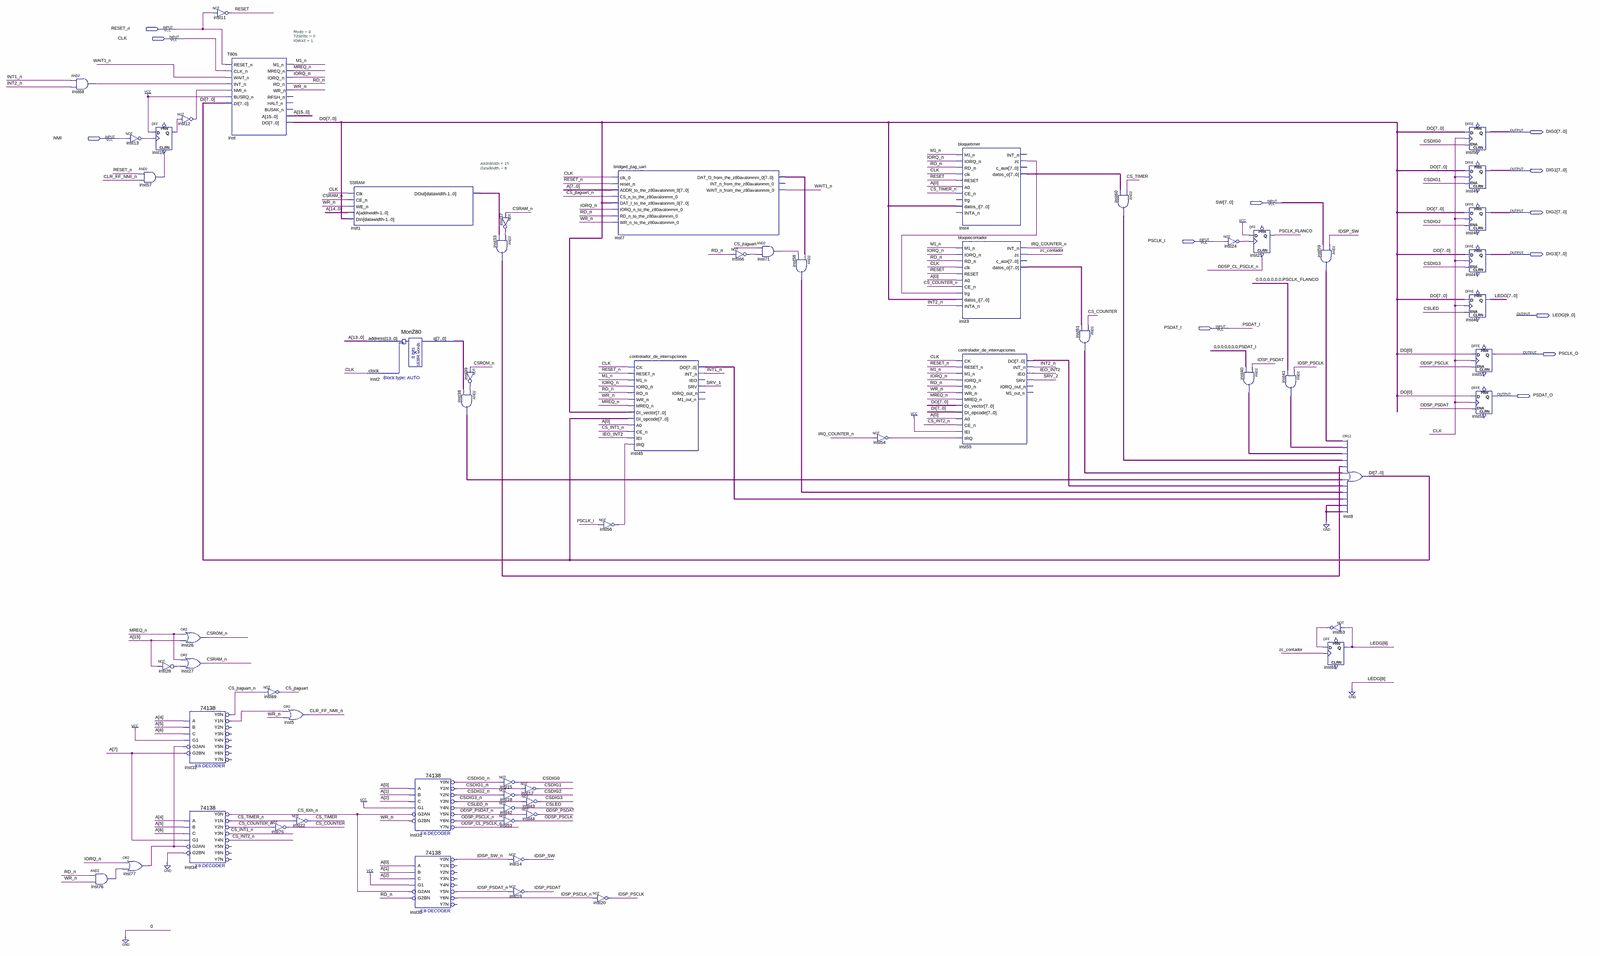
[diagram p0: schematic sheet, whole]
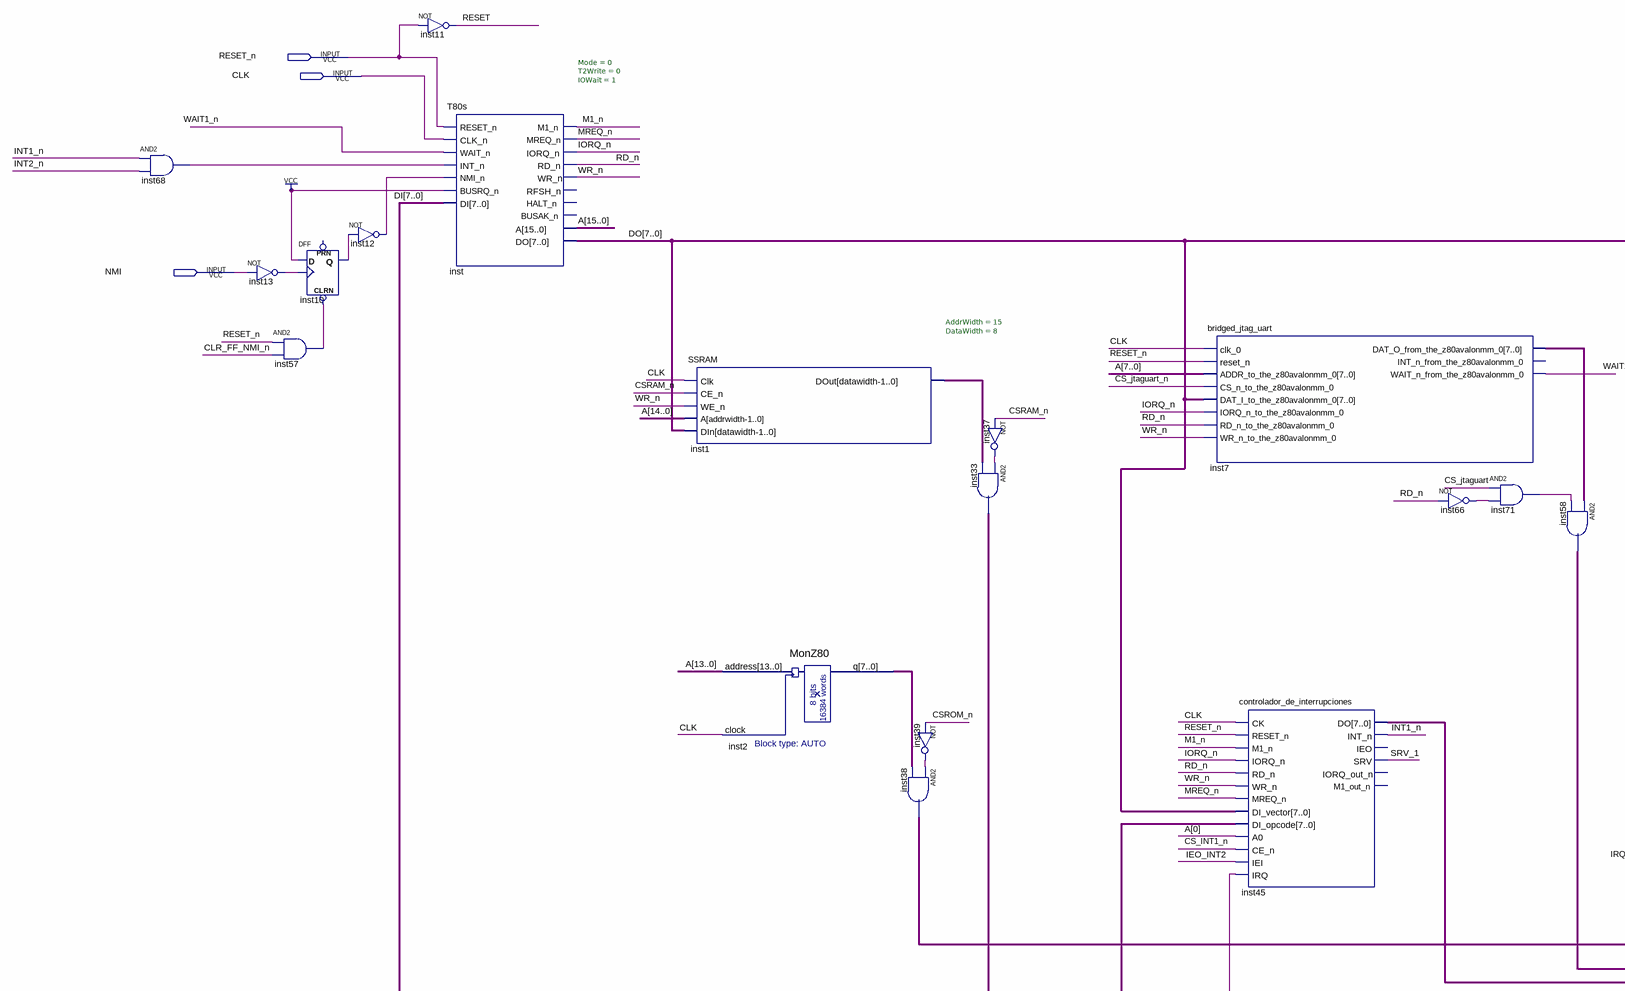
[diagram p1: schematic sheet, upper left part]
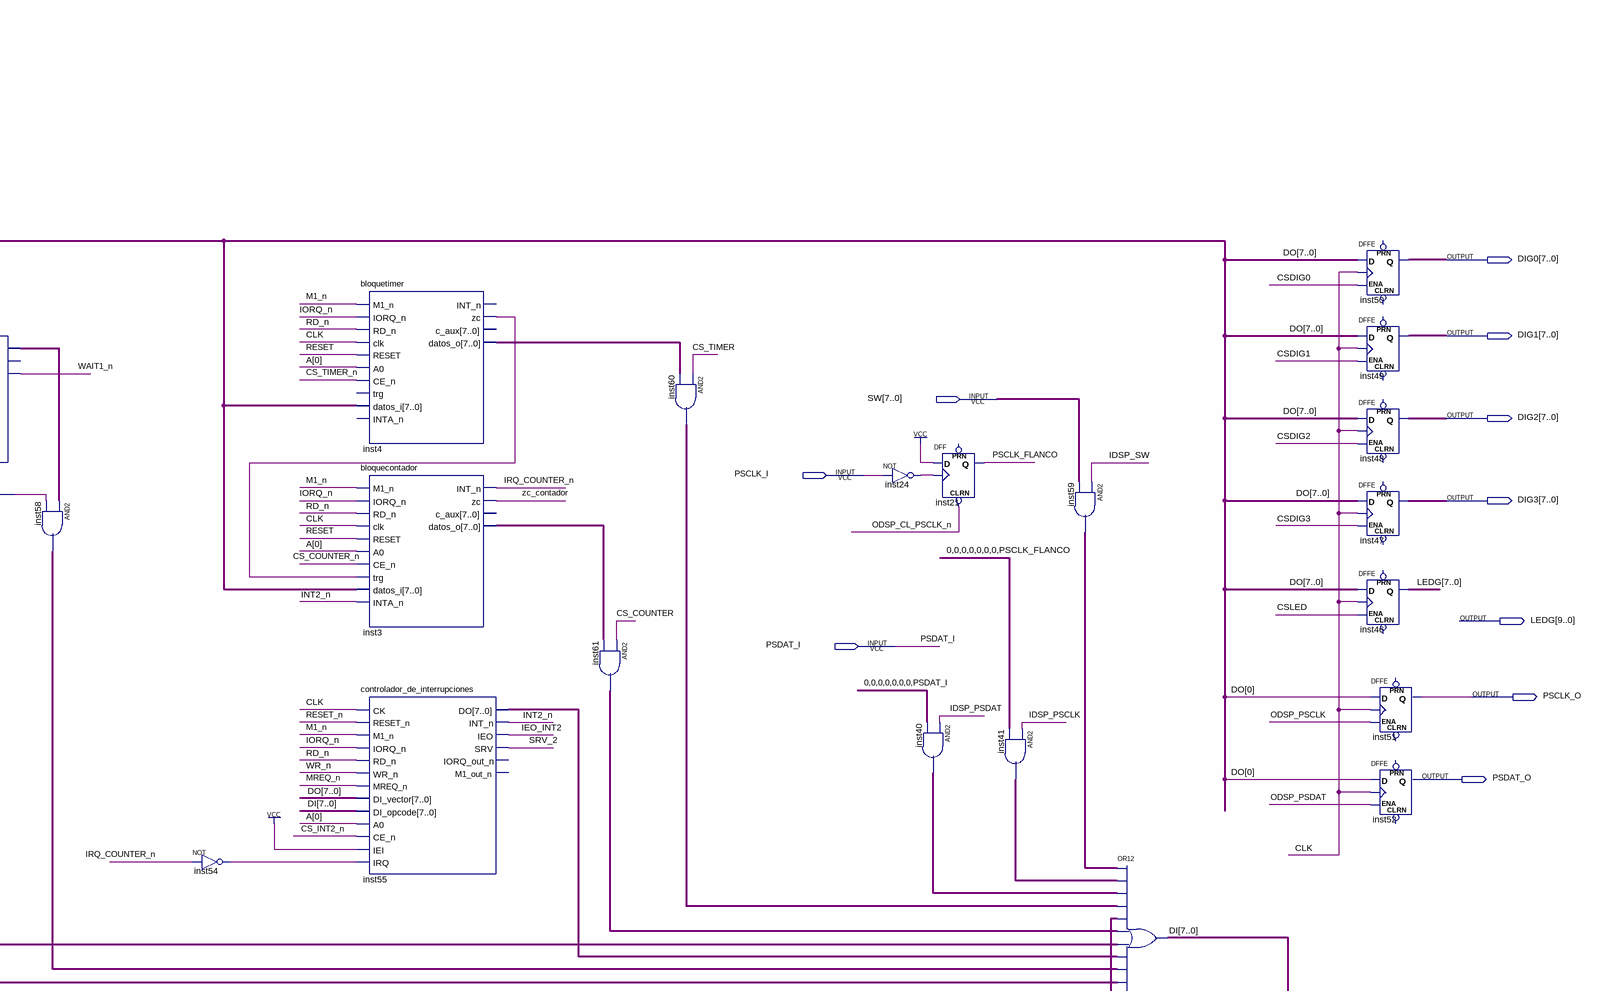
[diagram p2: schematic sheet, upper right part]
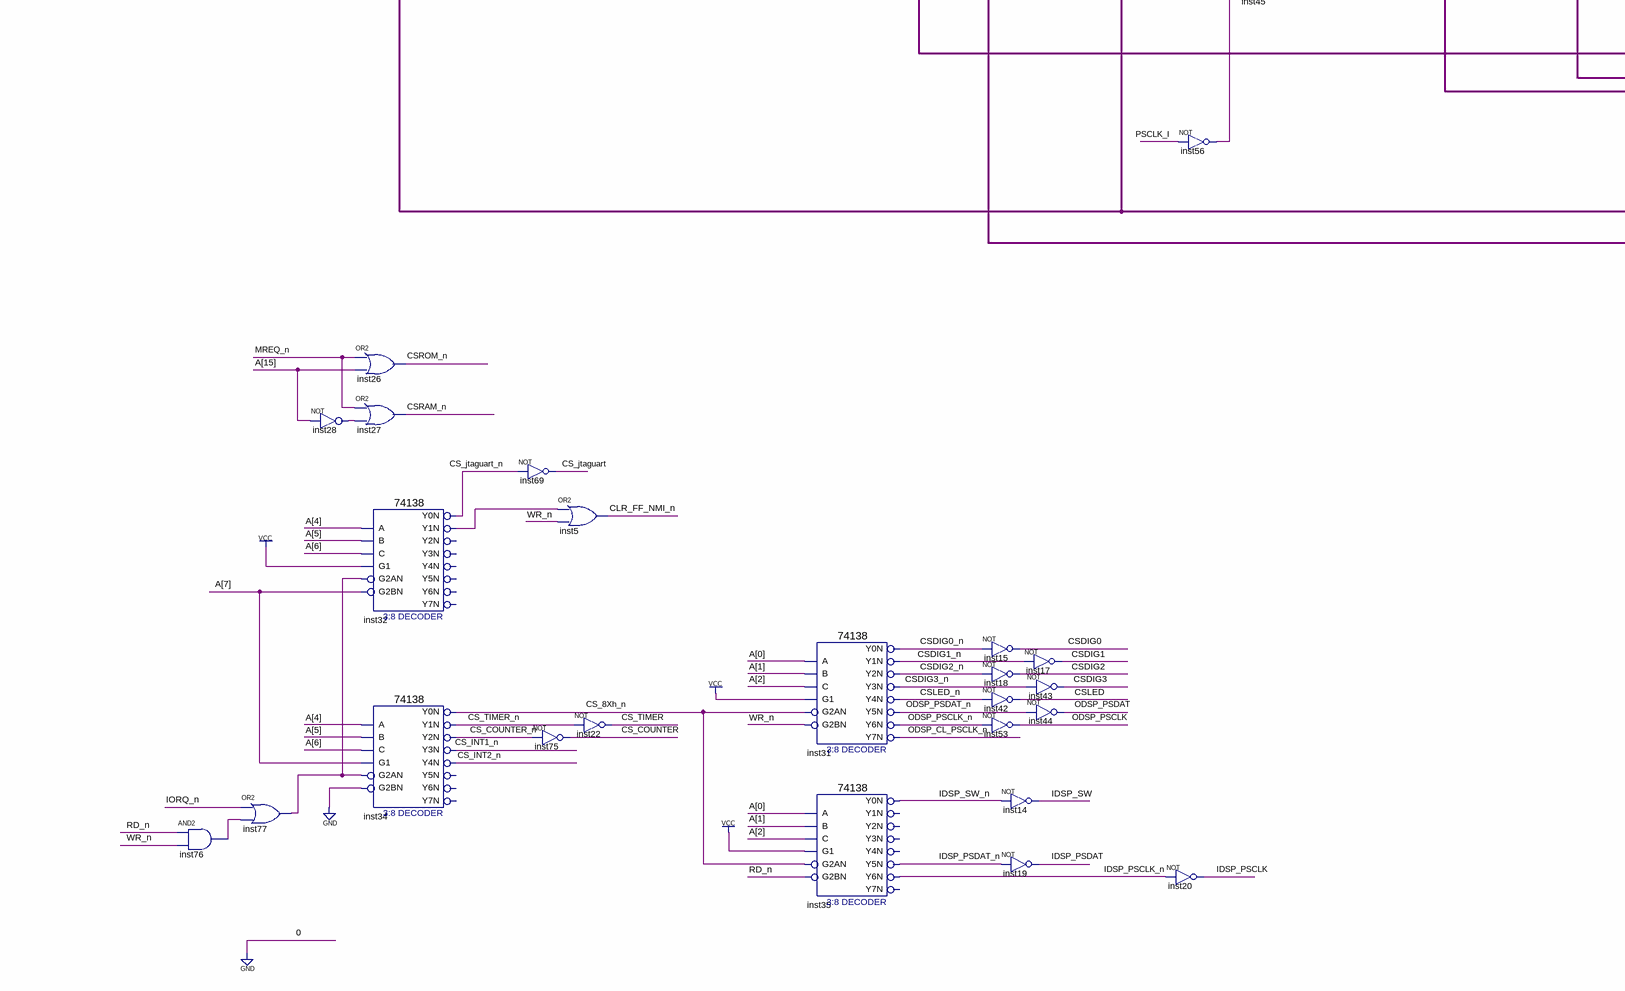
[diagram p3: schematic sheet, lower left part]
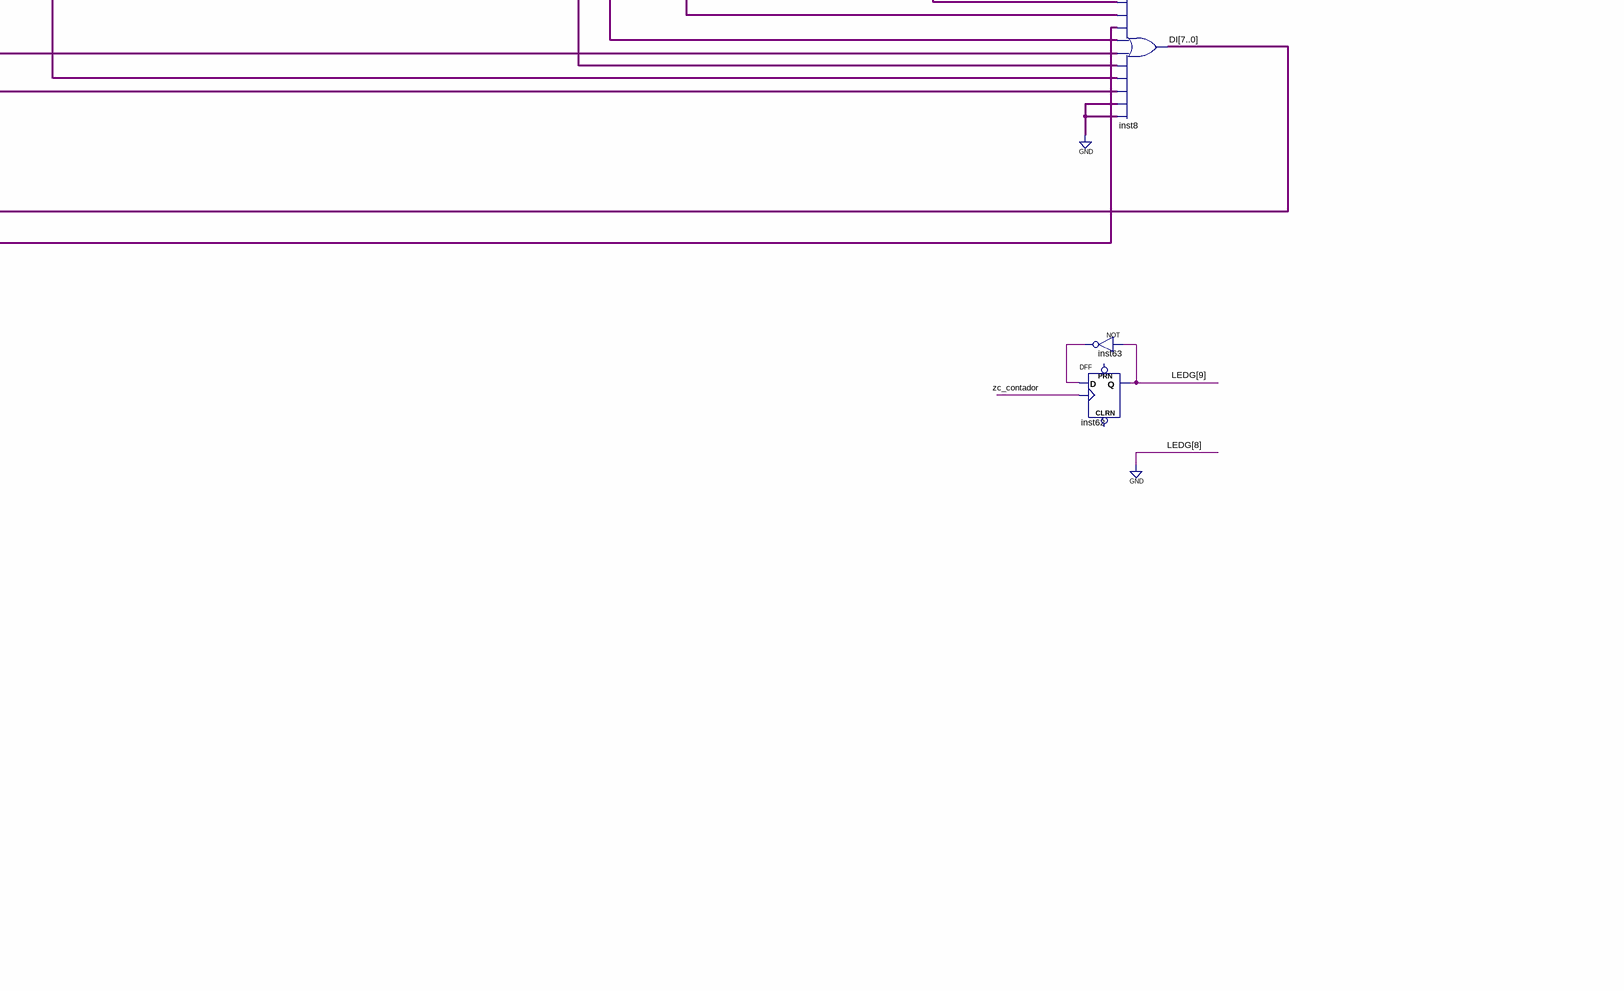
[diagram p4: schematic sheet, lower right part]
// Quartus schematic sistema.bdf as structural Verilog: 63 symbols, 13 pins
module sistema (
  input  RESET_n,
  input  CLK,
  input  NMI,
  input  [7:0] SW,
  input  PSCLK_I,
  input  PSDAT_I,
  output [7:0] DIG0,
  output [7:0] DIG1,
  output [7:0] DIG2,
  output [7:0] DIG3,
  output [9:0] LEDG,
  output PSCLK_O,
  output PSDAT_O
);

  wire CLR_FF_NMI_n, CS_8Xh_n, CS_COUNTER, CS_COUNTER_n, CS_INT1_n, CS_INT2_n, CS_jtaguart, CS_jtaguart_n,
       CS_TIMER, CS_TIMER_n, CSDIG0, CSDIG0_n, CSDIG1, CSDIG1_n, CSDIG2, CSDIG2_n, CSDIG3, CSDIG3_n, CSLED,
       CSLED_n, CSRAM_n, CSROM_n, IDSP_PSCLK, IDSP_PSCLK_n, IDSP_PSDAT, IDSP_PSDAT_n, IDSP_SW, IDSP_SW_n,
       IEO_INT2, inst4_zc, inst10_q, inst12_out, inst13_out, inst24_out, inst28_out, inst32_y1n, inst37_out,
       inst39_out, inst54_out, inst56_out, inst57_out, inst63_out, inst66_out, inst68_out, inst71_out,
       inst76_out, inst77_out, INT1_n, INT2_n, IORQ_n, IRQ_COUNTER_n, M1_n, MREQ_n, ODSP_CL_PSCLK_n,
       ODSP_PSCLK, ODSP_PSCLK_n, ODSP_PSDAT, ODSP_PSDAT_n, PSCLK_FLANCO, RD_n, RESET, SRV_1, SRV_2, WAIT1_n,
       WR_n, zc_contador;
  wire [7:0] DI, DO, inst1_dout, inst2_q, inst3_datos_o, inst4_datos_o, inst7_dat_o_from_the_z80avalonmm_0,
       inst33_out, inst38_out, inst40_out, inst41_out, inst45_do, inst55_do, inst58_out, inst59_out,
       inst60_out, inst61_out;
  wire [15:0] A;

  and inst68 (inst68_out, INT1_n, INT2_n);
  and inst76 (inst76_out, RD_n, WR_n);
  not inst13 (inst13_out, NMI);
  or inst77 (inst77_out, IORQ_n, inst76_out);
  DFF inst10 (.CLRN(inst57_out), .CLK(inst13_out), .D(1'b1), .Q(inst10_q));  // open: PRN
  and inst57 (inst57_out, RESET_n, CLR_FF_NMI_n);
  not inst12 (inst12_out, inst10_q);
  not inst28 (inst28_out, A[15]);
  or inst26 (CSROM_n, MREQ_n, A[15]);
  or inst27 (CSRAM_n, MREQ_n, inst28_out);
  \74138  inst32 (
    .A(A[4]), .B(A[5]), .G1(1'b1), .C(A[6]), .G2AN(inst77_out), .G2BN(A[7]), .Y0N(CS_jtaguart_n),
    .Y1N(inst32_y1n));  // open: Y2N, Y3N, Y4N, Y5N, Y6N, Y7N
  \74138  inst34 (
    .A(A[4]), .B(A[5]), .G1(A[7]), .C(A[6]), .G2AN(inst77_out), .G2BN(1'b0), .Y0N(CS_8Xh_n),
    .Y1N(CS_TIMER_n), .Y2N(CS_COUNTER_n), .Y3N(CS_INT1_n), .Y4N(CS_INT2_n));  // open: Y5N, Y6N, Y7N
  not inst11 (RESET, RESET_n);
  T80s #(.Mode(0), .T2Write(0), .IOWait(1)) inst (
    .RESET_n(RESET_n), .CLK_n(CLK), .WAIT_n(WAIT1_n), .INT_n(inst68_out), .NMI_n(inst12_out), .BUSRQ_n(1'b1),
    .DI(DI), .M1_n(M1_n), .MREQ_n(MREQ_n), .IORQ_n(IORQ_n), .RD_n(RD_n), .WR_n(WR_n), .A(A), .DO(DO));  // open: RFSH_n, HALT_n, BUSAK_n
  not inst69 (CS_jtaguart, CS_jtaguart_n);
  not inst75 (CS_COUNTER, CS_COUNTER_n);
  or inst5 (CLR_FF_NMI_n, inst32_y1n, WR_n);
  not inst22 (CS_TIMER, CS_TIMER_n);
  SSRAM #(.AddrWidth(15), .DataWidth(8)) inst1 (
    .Clk(CLK), .CE_n(CSRAM_n), .WE_n(WR_n), .A(A[14:0]), .DIn(DO), .DOut(inst1_dout));
  MonZ80 inst2 (.address(A[13:0]), .clock(CLK), .q(inst2_q));
  \74138  inst31 (
    .A(A[0]), .B(A[1]), .G1(1'b1), .C(A[2]), .G2AN(CS_8Xh_n), .G2BN(WR_n), .Y0N(CSDIG0_n), .Y1N(CSDIG1_n),
    .Y2N(CSDIG2_n), .Y3N(CSDIG3_n), .Y4N(CSLED_n), .Y5N(ODSP_PSDAT_n), .Y6N(ODSP_PSCLK_n),
    .Y7N(ODSP_CL_PSCLK_n));
  \74138  inst35 (
    .A(A[0]), .B(A[1]), .G1(1'b1), .C(A[2]), .G2AN(CS_8Xh_n), .G2BN(RD_n), .Y0N(IDSP_SW_n),
    .Y5N(IDSP_PSDAT_n), .Y6N(IDSP_PSCLK_n));  // open: Y1N, Y2N, Y3N, Y4N, Y7N
  assign inst38_out = {8{inst39_out}} & inst2_q;  // AND2 inst38, 8 bits wide
  not inst39 (inst39_out, CSROM_n);
  not inst37 (inst37_out, CSRAM_n);
  assign inst33_out = {8{inst37_out}} & inst1_dout;  // AND2 inst33, 8 bits wide
  not inst15 (CSDIG0, CSDIG0_n);
  not inst18 (CSDIG2, CSDIG2_n);
  not inst42 (CSLED, CSLED_n);
  not inst53 (ODSP_PSCLK, ODSP_PSCLK_n);
  not inst14 (IDSP_SW, IDSP_SW_n);
  not inst19 (IDSP_PSDAT, IDSP_PSDAT_n);
  not inst17 (CSDIG1, CSDIG1_n);
  not inst43 (CSDIG3, CSDIG3_n);
  not inst44 (ODSP_PSDAT, ODSP_PSDAT_n);
  bridged_jtag_uart inst7 (
    .clk_0(CLK), .reset_n(RESET_n), .ADDR_to_the_z80avalonmm_0(A[7:0]),
    .CS_n_to_the_z80avalonmm_0(CS_jtaguart_n), .DAT_I_to_the_z80avalonmm_0(DO),
    .IORQ_n_to_the_z80avalonmm_0(IORQ_n), .RD_n_to_the_z80avalonmm_0(RD_n), .WR_n_to_the_z80avalonmm_0(WR_n),
    .DAT_O_from_the_z80avalonmm_0(inst7_dat_o_from_the_z80avalonmm_0), .WAIT_n_from_the_z80avalonmm_0(WAIT1_n));  // open: INT_n_from_the_z80avalonmm_0
  not inst56 (inst56_out, PSCLK_I);
  not inst20 (IDSP_PSCLK, IDSP_PSCLK_n);
  controlador_de_interrupciones inst45 (
    .CK(CLK), .RESET_n(RESET_n), .M1_n(M1_n), .IORQ_n(IORQ_n), .RD_n(RD_n), .WR_n(WR_n), .MREQ_n(MREQ_n),
    .DI_vector(DO), .DI_opcode(DI), .A0(A[0]), .CE_n(CS_INT1_n), .IEI(IEO_INT2), .IRQ(inst56_out),
    .DO(inst45_do), .INT_n(INT1_n), .SRV(SRV_1));  // open: IEO, IORQ_out_n, M1_out_n
  not inst66 (inst66_out, RD_n);
  and inst71 (inst71_out, CS_jtaguart, inst66_out);
  assign inst58_out = inst7_dat_o_from_the_z80avalonmm_0 & {8{inst71_out}};  // AND2 inst58, 8 bits wide
  not inst54 (inst54_out, IRQ_COUNTER_n);
  bloquetimer inst4 (
    .M1_n(M1_n), .IORQ_n(IORQ_n), .RD_n(RD_n), .clk(CLK), .RESET(RESET), .A0(A[0]), .CE_n(CS_TIMER_n),
    .datos_i(DO), .zc(inst4_zc), .datos_o(inst4_datos_o));  // open: trg, INTA_n, INT_n, c_aux
  bloquecontador inst3 (
    .M1_n(M1_n), .IORQ_n(IORQ_n), .RD_n(RD_n), .clk(CLK), .RESET(RESET), .A0(A[0]), .CE_n(CS_COUNTER_n),
    .trg(inst4_zc), .datos_i(DO), .INTA_n(INT2_n), .INT_n(IRQ_COUNTER_n), .zc(zc_contador),
    .datos_o(inst3_datos_o));  // open: c_aux
  controlador_de_interrupciones inst55 (
    .CK(CLK), .RESET_n(RESET_n), .M1_n(M1_n), .IORQ_n(IORQ_n), .RD_n(RD_n), .WR_n(WR_n), .MREQ_n(MREQ_n),
    .DI_vector(DO), .DI_opcode(DI), .A0(A[0]), .CE_n(CS_INT2_n), .IEI(1'b1), .IRQ(inst54_out),
    .DO(inst55_do), .INT_n(INT2_n), .IEO(IEO_INT2), .SRV(SRV_2));  // open: IORQ_out_n, M1_out_n
  assign inst61_out = {8{CS_COUNTER}} & inst3_datos_o;  // AND2 inst61, 8 bits wide
  assign inst60_out = {8{CS_TIMER}} & inst4_datos_o;  // AND2 inst60, 8 bits wide
  not inst24 (inst24_out, PSCLK_I);
  DFF inst21 (.CLRN(ODSP_CL_PSCLK_n), .CLK(inst24_out), .D(1'b1), .Q(PSCLK_FLANCO));  // open: PRN
  assign inst40_out = {8{IDSP_PSDAT}} & {{7{1'b0}}, PSDAT_I};  // AND2 inst40, 8 bits wide
  assign inst41_out = {8{IDSP_PSCLK}} & {{7{1'b0}}, PSCLK_FLANCO};  // AND2 inst41, 8 bits wide
  assign inst59_out = {8{IDSP_SW}} & SW;  // AND2 inst59, 8 bits wide
  not inst63 (inst63_out, LEDG[9]);
  DFF inst62 (.CLK(zc_contador), .D(inst63_out), .Q(LEDG[9]));  // open: CLRN, PRN
  assign DI = inst59_out | inst41_out | inst40_out | inst60_out | inst33_out | inst61_out | inst38_out | inst55_do | inst58_out | inst45_do | {8{1'b0}} | {8{1'b0}};  // OR12 inst8, 8 bits wide
  DFFE inst50[7:0] (.D(DO), .CLK(CLK), .ENA(CSDIG0), .Q(DIG0));  // open: PRN, CLRN
  DFFE inst49[7:0] (.D(DO), .CLK(CLK), .ENA(CSDIG1), .Q(DIG1));  // open: PRN, CLRN
  DFFE inst48[7:0] (.D(DO), .CLK(CLK), .ENA(CSDIG2), .Q(DIG2));  // open: PRN, CLRN
  DFFE inst47[7:0] (.D(DO), .CLK(CLK), .ENA(CSDIG3), .Q(DIG3));  // open: PRN, CLRN
  DFFE inst46[7:0] (.D(DO), .CLK(CLK), .ENA(CSLED), .Q(LEDG[7:0]));  // open: PRN, CLRN
  DFFE inst51 (.D(DO[0]), .CLK(CLK), .ENA(ODSP_PSCLK), .Q(PSCLK_O));  // open: PRN, CLRN
  DFFE inst52 (.D(DO[0]), .CLK(CLK), .ENA(ODSP_PSDAT), .Q(PSDAT_O));  // open: PRN, CLRN

  assign LEDG[8] = 1'b0;
endmodule
